# Altium schematic sheet ControlVCC.SchDoc
size A
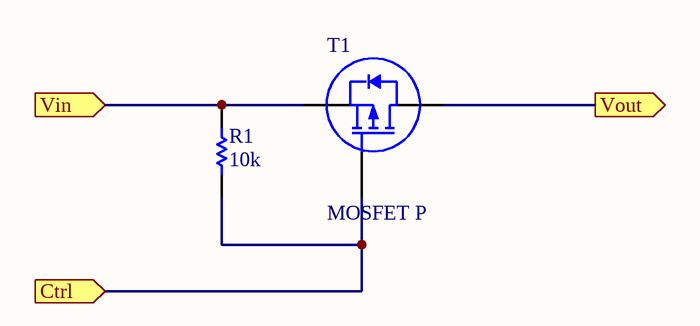
[diagram p0: ControlVCC.SchDoc]

## Parts
R1  10k  [0805]
T1  MOSFET P  [SOT23]

## Ports
Ctrl (in), Vin (in), Vout (out)

## Nets
Ctrl: R1.1 T1.1(G) ; port Ctrl
Vin: R1.2 T1.3(S) ; port Vin
Vout: T1.2(D) ; port Vout

## Library data of the parts
R1 = RES